# Altium project canbus_motor_drive.PrjPcb
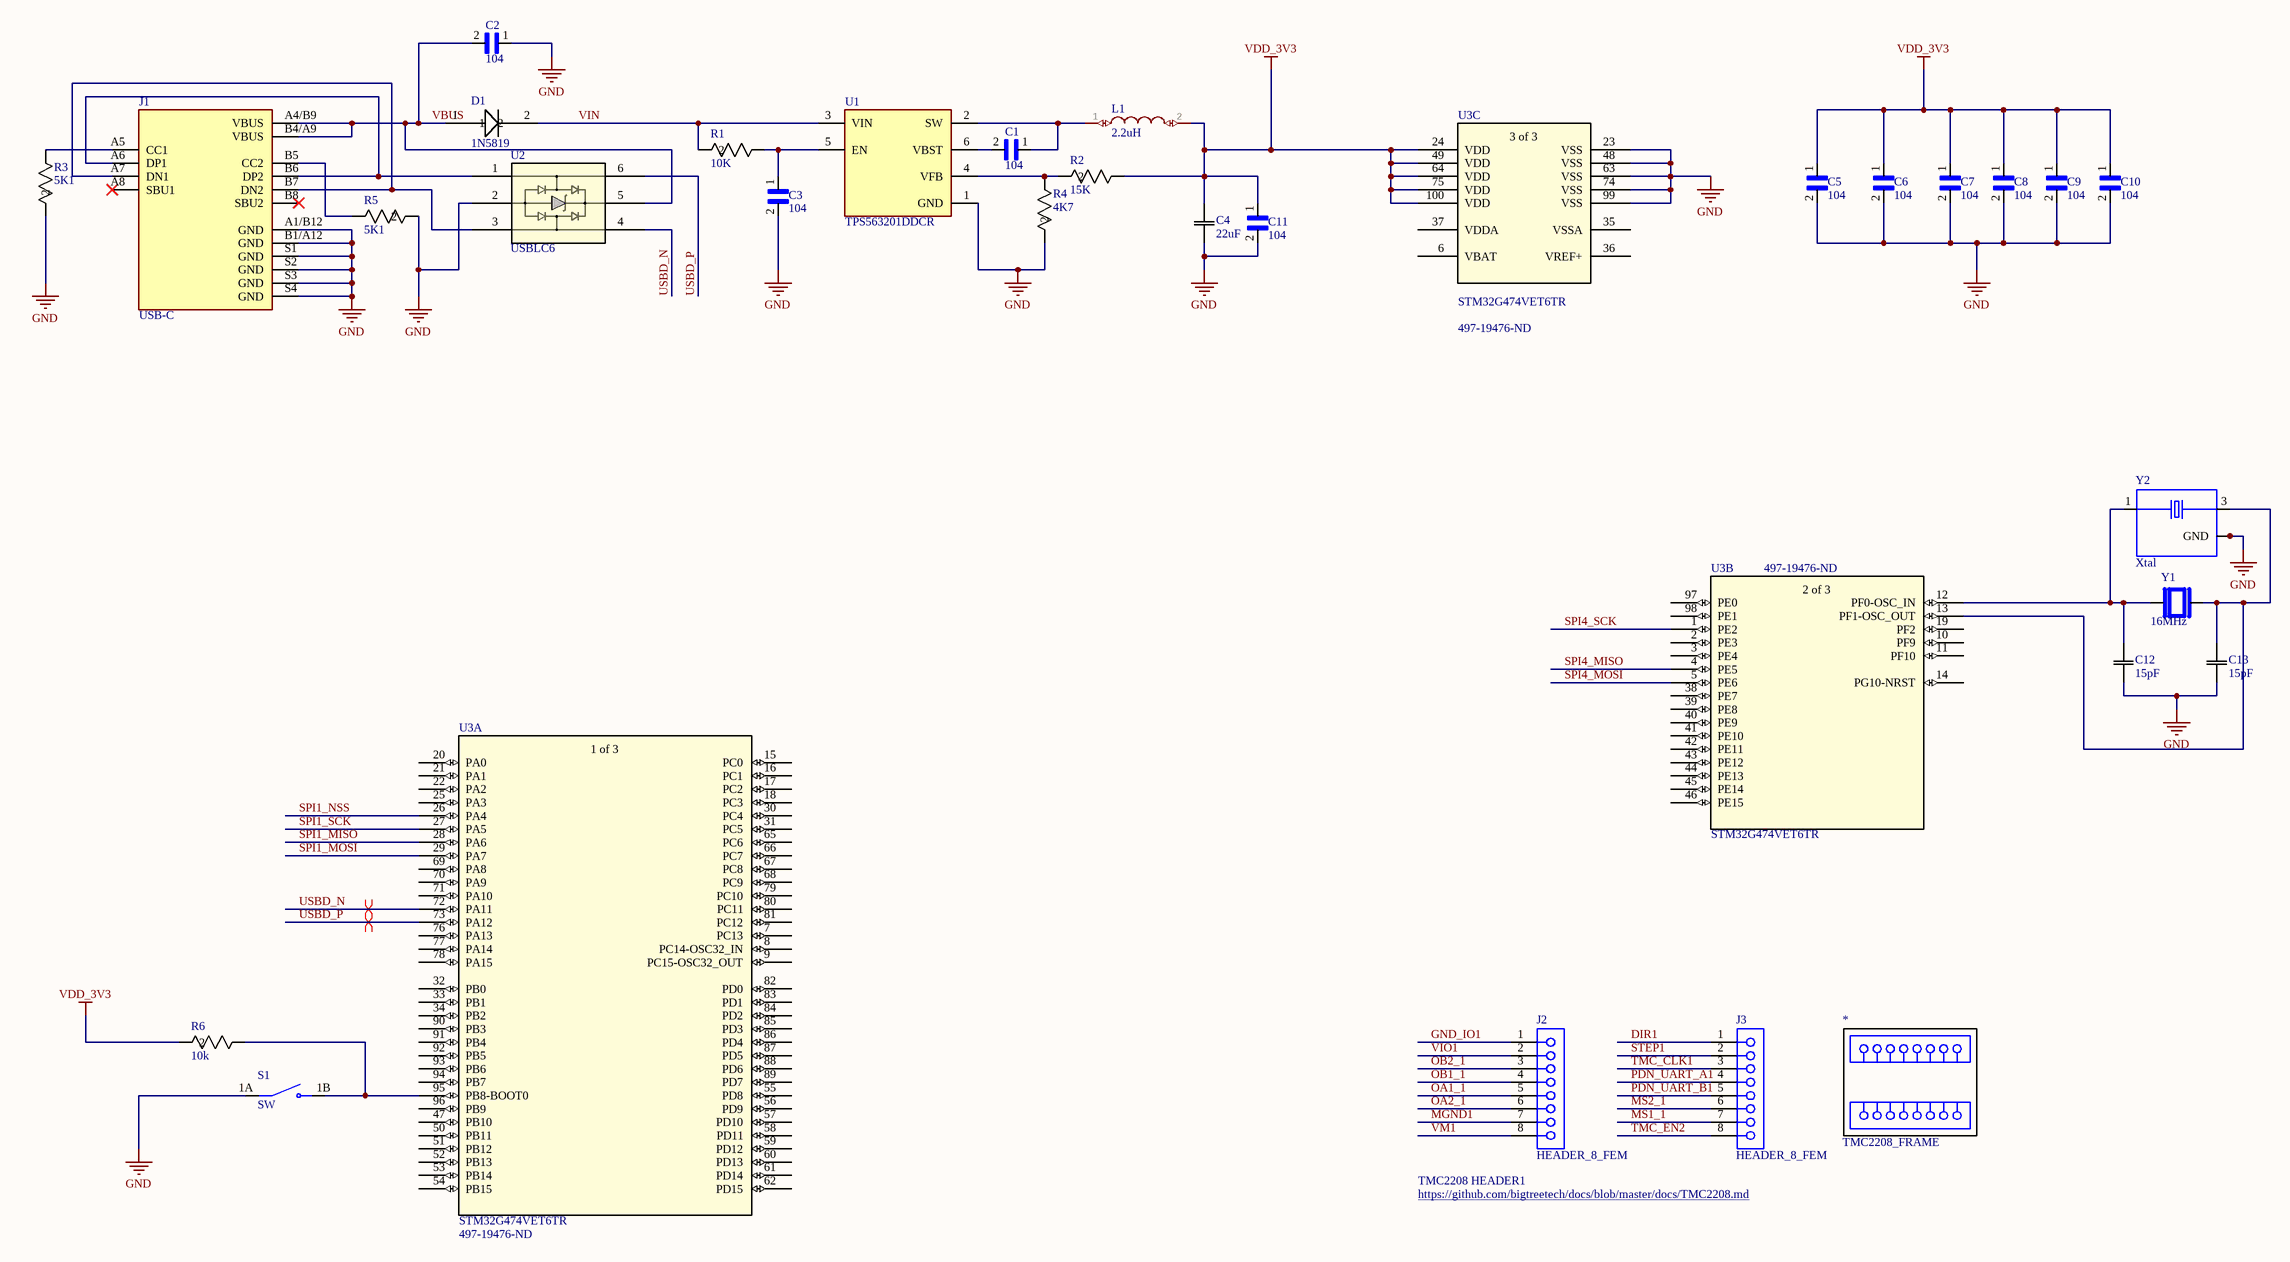
[diagram p0: main.SchDoc]
1 sheet, 31 parts. Net scope: global (net labels, ports and power ports of the same name join across sheets).
Board file: main.PcbDoc

## Sheet main.SchDoc
size C; SheetNumber: 1; SheetTotal: 1

### Parts
*  TMC2208_FRAME
C1  104  [CAPC1005X55N2]
C2  104  [CAPC1005X55N2]
C3  104  [CAPC1005X55N2]
C4  22uF  [CAP_CC0805_YAG]
C5  104  [CAPC1005X55N2]
C6  104  [CAPC1005X55N2]
C7  104  [CAPC1005X55N2]
C8  104  [CAPC1005X55N2]
C9  104  [CAPC1005X55N2]
C10  104  [CAPC1005X55N2]
C11  104  [CAPC1005X55N2]
C12  15pF  [CC0402N_YAG-L]
C13  15pF  [CC0402N_YAG-L]
D1  1N5819  [1N5819HW-7-F_DIO]
J1  USB-C  [GCT_USB4110GFA]
J2  HEADER_8_FEM  [HEADER_8_FEM]
J3  HEADER_8_FEM  [HEADER_8_FEM]
L1  2.2uH  [CDRH2D14]
R1  10K  [RC0402]
R2  15K  [RC0402]
R3  5K1  [RC0402]
R4  4K7  [RC0402]
R5  5K1  [RC0402]
R6  10k  [RC0402]
S1  SW  [SW_DS04-254-2-01BK-SMT]
U1  TPS563201DDCR  [SOT95P280X110-6N]
U2  USBLC6  [SOT23-6L_STM]
U3  STM32G474VET6TR  Supplier Part Number 1: 497-19476-ND  [STM32G474VET6TR]  (parts A,B,C of 3)
Y1  16MHz  [ABM3-16.000MHZ-D2Y-T]
Y2  Xtal  [OSCCC320X250X60N]

### Nets
GND: C2.1 C3.2 C4.1 C5.2 C6.2 C7.2 C8.2 C9.2 C10.2 C11.2 C12.1 C13.1 J1.A1/B12(GND) J1.B1/A12(GND) J1.S1(GND) J1.S2(GND) J1.S3(GND) J1.S4(GND) R3.2 R4.2 R5.2 S1.1A(COM) U1.1(GND) U2.2 U3.23(VSS) U3.48(VSS) U3.63(VSS) U3.74(VSS) U3.99(VSS) Y2.2(GND) Y2.4(GND)
VDD_3V3: C4.2 C5.1 C6.1 C7.1 C8.1 C9.1 C10.1 C11.1 L1.2 R2.1 R6.2 U3.24(VDD) U3.49(VDD) U3.64(VDD) U3.75(VDD) U3.100(VDD)
DIR1: J3.1
GND_IO1: J2.1
MGND1: J2.7
MS1_1: J3.7
MS2_1: J3.6
OA1_1: J2.5
OA2_1: J2.6
OB1_1: J2.4
OB2_1: J2.3
PDN_UART_A1: J3.4
PDN_UART_B1: J3.5
SPI1_MISO: U3.28(PA6)
SPI1_MOSI: U3.29(PA7)
SPI1_NSS: U3.26(PA4)
SPI1_SCK: U3.27(PA5)
SPI4_MISO: U3.4(PE5)
SPI4_MOSI: U3.5(PE6)
SPI4_SCK: U3.1(PE2)
STEP1: J3.2
TMC_CLK1: J3.3
TMC_EN2: J3.8
USBD_N: U2.4 U3.72(PA11)
USBD_P: U2.6 U3.73(PA12)
VBUS: C2.2 D1.1 J1.A4/B9(VBUS) J1.B4/A9(VBUS) U2.5
VIN: D1.2 R1.2 U1.3(VIN)
VIO1: J2.2
VM1: J2.8
NetC1_1: C1.1 L1.1 U1.2(SW)
NetC1_2: C1.2 U1.6(VBST)
NetC3_1: C3.1 R1.1 U1.5(EN)
NetC12_2: C12.2 U3.12(PF0-OSC_IN) Y1.1 Y2.1
NetC13_2: C13.2 U3.13(PF1-OSC_OUT) Y1.2 Y2.3
NetJ1_A5: J1.A5(CC1) R3.1
NetJ1_A6: J1.A6(DP1) J1.B6(DP2) U2.1
NetJ1_A7: J1.A7(DN1) J1.B7(DN2) U2.3
NetJ1_B5: J1.B5(CC2) R5.1
NetR2_2: R2.2 R4.1 U1.4(VFB)
NetR6_1: R6.1 S1.1B(NO) U3.95(PB8-BOOT0)

Not connected (* = marked no-connect by the designer): J1 A8(SBU1)* B8(SBU2)*; U3 2(PE3) 3(PE4) 6(VBAT) 7(PC13) 8(PC14-OSC32_IN) 9(PC15-OSC32_OUT) 10(PF9) 11(PF10) 14(PG10-NRST) 15(PC0) 16(PC1) 17(PC2) 18(PC3) 19(PF2) 20(PA0) 21(PA1) 22(PA2) 25(PA3) 30(PC4) 31(PC5) 32(PB0) 33(PB1) 34(PB2) 35(VSSA) 36(VREF+) 37(VDDA) 38(PE7) 39(PE8) 40(PE9) 41(PE10) 42(PE11) 43(PE12) 44(PE13) 45(PE14) 46(PE15) 47(PB10) 50(PB11) 51(PB12) 52(PB13) 53(PB14) 54(PB15) 55(PD8) 56(PD9) 57(PD10) 58(PD11) 59(PD12) 60(PD13) 61(PD14) 62(PD15) 65(PC6) 66(PC7) 67(PC8) 68(PC9) 69(PA8) 70(PA9) 71(PA10) 76(PA13) 77(PA14) 78(PA15) 79(PC10) 80(PC11) 81(PC12) 82(PD0) 83(PD1) 84(PD2) 85(PD3) 86(PD4) 87(PD5) 88(PD6) 89(PD7) 90(PB3) 91(PB4) 92(PB5) 93(PB6) 94(PB7) 96(PB9) 97(PE0) 98(PE1)

### Layout directives
differential pair: USBD_N, USBD_P

### Notes on the sheet
- (near J2) TMC2208 HEADER1
- https://github.com/bigtreetech/docs/blob/master/docs/TMC2208.md
- (in symbol STM32G474VET6, part A) 1 of 3
- (in symbol STM32G474VET6, part B) 2 of 3
- (in symbol STM32G474VET6, part C) 3 of 3

### Library data of the parts
C1-C3 C5-C11 = CC0402KRX7R7BB104: Multilayer Ceramic Capacitor, 0.1 uF, 16 V, ï¿½ 10%, X7R, 0402 [1005 Metric]; Manufacturer: Yageo; Material: 4241ConductorMaterial; Capacitance: 100nF; Voltage Rating: 16V; Temperature Coefficient: 30ppm/°C; Supplier 1: Digikey; Manufacturer Part Number: CC0402KRX7R7BB104; RoHS: Yes; Category: Ceramic Capacitors; Stock 1: 15609894; Pricing 1: 1=0.1, 10=0.024, 50=0.0164, 100=0.0139, 500=0.0098, 1000=0.00852, 2500=0.00718, 5000=0.00636 (USD); Mount: Surface Mount; Case/Package: 0402; Number of Pins: 2; Case Code (Metric): 1005; Case Code (Imperial): 0402; Min Operating Temperature: -55°C; Max Operating Temperature: 125°C; Tolerance: 10%; Voltage Rating (DC): 16V; Packaging: Tape and Reel; Package Quantity: 1; Dielectric: X7R; Termination: SMD/SMT; Voltage: 16V; Series: CC; Voltage Rating (AC): 16V; Length: 1mm; Width: 0.02inch; Height: 0.5mm; Thickness: 0.022inch; Depth: 0.5mm; Radiation Hardening: No; Reach SVHC Compliant: No; RoHS Compliant: Yes; Halogen Free: 5694HalogenFree; Lead Free: 5697LeadFree; ComponentLink1URL: https://datasheet.ciiva.com/11788/0900766b80ce67ed-11788364.pdf?src-supplier=Rs; ComponentLink1Description: https://datasheet.ciiva.com/11788/0900766b80ce67ed-11788364.pdf?src-supplier=Rs; ComponentLink2URL: https://datasheet.ciiva.com/7978/1489800-7978111.pdf?src-supplier=Element14; ComponentLink2Description: https://datasheet.ciiva.com/7978/1489800-7978111.pdf?src-supplier=Element14; ComponentLink3URL: https://datasheet.ciiva.com/161/mlccorderingcode-161545.pdf?src-supplier=Digikey; ComponentLink3Description: https://datasheet.ciiva.com/161/mlccorderingcode-161545.pdf?src-supplier=Digikey; ComponentLink4URL: https://datasheet.ciiva.com/161/mlccorderingcode-161544.pdf?src-supplier=Digikey; ComponentLink4Description: https://datasheet.ciiva.com/161/mlccorderingcode-161544.pdf?src-supplier=Digikey; ComponentLink5URL: https://datasheet.ciiva.com/161/mlccorderingcode-161546.pdf?src-supplier=Digikey; ComponentLink5Description: https://datasheet.ciiva.com/161/mlccorderingcode-161546.pdf?src-supplier=Digikey; ComponentLink6URL: https://datasheet.ciiva.com/8033/1734573-8033661.pdf?src-supplier=Element14; ComponentLink6Description: https://datasheet.ciiva.com/8033/1734573-8033661.pdf?src-supplier=Element14; ComponentLink7URL: https://datasheet.ciiva.com/11587/upy-gphc-x7r-6-3v-to-50v-8-11587305.pdf?src-supplier=Avnet; ComponentLink7Description: https://datasheet.ciiva.com/11587/upy-gphc-x7r-6-3v-to-50v-8-11587305.pdf?src-supplier=Avnet; LCSC: C60474; Supplier Part Number 1: 311-1338-1-ND
C4 = CC0805MKX5R6BB226: Multilayer Ceramic Capacitor, 22 uF, 10 V, ± 20%, X5R, 0805 [2012 Metric]; Manufacturer: Yageo; Supplier 1: Digikey; Manufacturer Part Number: CC0805MKX5R6BB226; RoHS: Yes; Category: Ceramic Capacitors; Stock 1: 418703; Pricing 1: 1=0.39, 10=0.229, 50=0.1654, 100=0.1457, 500=0.11208, 1000=0.10161 (USD); Lead Free: 5697LeadFree; Halogen Free: 5694HalogenFree; ComponentLink1URL: https://datasheet.ciiva.com/26863/getdatasheetpartid-573628-26863004.pdf?src-supplier=Verical; ComponentLink1Description: https://datasheet.ciiva.com/26863/getdatasheetpartid-573628-26863004.pdf?src-supplier=Verical; LCSC: C109314; Supplier Part Number 1: 311-1900-1-ND
C12 C13 = CC0402JRNPO9BN150: Multilayer Ceramic Capacitor, 15 pF, 50 V, ± 5%, C0G (NP0), 0402 [1005 Metric]; Manufacturer: Yageo; Dielectric Material: 4241ConductorMaterial; Voltage Rating: 50V; Temperature Coefficient: 30ppm/°C; Insulation Resistance: 100GR; Supplier 1: Digikey; Manufacturer Part Number: CC0402JRNPO9BN150; RoHS: Yes; Category: Ceramic Capacitors; Stock 1: 476708; Pricing 1: 1=0.1, 10=0.023, 50=0.0152, 100=0.0129, 500=0.00904, 1000=0.00785, 2500=0.0066, 5000=0.00584 (USD); Mount: Surface Mount; Case/Package: 0402; Number of Pins: 2; Case Code (Metric): 1005; Case Code (Imperial): 0402; Min Operating Temperature: -55°C; Max Operating Temperature: 125°C; Capacitance: 15pF; Tolerance: 5%; Voltage Rating (DC): 50V; Package Quantity: 1; Packaging: Tape and Reel; Dielectric: C0G; Termination: SMD/SMT; Voltage: 50V; Series: CC; Voltage Rating (AC): 50V; Length: 1mm; Width: 0.02inch; Height: 0.5mm; Thickness: 0.022inch; Depth: 0.5mm; Radiation Hardening: No; Reach SVHC Compliant: No; RoHS Compliant: Yes; Halogen Free: 5694HalogenFree; Lead Free: 5697LeadFree; ComponentLink1URL: https://datasheet.ciiva.com/144/mlccorderingcode-144002.pdf?src-supplier=Digikey; ComponentLink1Description: https://datasheet.ciiva.com/144/mlccorderingcode-144002.pdf?src-supplier=Digikey; ComponentLink2URL: https://datasheet.ciiva.com/144/mlccorderingcode-144001.pdf?src-supplier=Digikey; ComponentLink2Description: https://datasheet.ciiva.com/144/mlccorderingcode-144001.pdf?src-supplier=Digikey; ComponentLink3URL: https://datasheet.ciiva.com/144/mlccorderingcode-144003.pdf?src-supplier=Digikey; ComponentLink3Description: https://datasheet.ciiva.com/144/mlccorderingcode-144003.pdf?src-supplier=Digikey; ComponentLink4URL: https://datasheet.ciiva.com/13386/upy-gp-np0-16v-to-50v-8-13386330.pdf?src-supplier=Mouser; ComponentLink4Description: https://datasheet.ciiva.com/13386/upy-gp-np0-16v-to-50v-8-13386330.pdf?src-supplier=Mouser; ComponentLink5URL: https://datasheet.ciiva.com/11587/upy-gp-np0-16v-to-50v-8-11587085.pdf?src-supplier=Avnet; ComponentLink5Description: https://datasheet.ciiva.com/11587/upy-gp-np0-16v-to-50v-8-11587085.pdf?src-supplier=Avnet; LCSC: C106997; Supplier Part Number 1: 311-1017-1-ND
D1 = 1N5819HW-7-F: 1N5819HW Series 40 V 1 A Surface Mount Schottky Barrier Rectifier - SOD-123; Manufacturer: Diodes; Forward Voltage: 450mV; Forward Current: 1A; Max Power Dissipation: 450mW; Max Reverse Current: 50uA; Max Repetitive Reverse Voltage (Vrrm): 40V; Max Forward Surge Current (Ifsm): 25A; Polarity: Standard; Capacitance: 50pF; Supplier 1: Digikey; Manufacturer Part Number: 1N5819HW-7-F; RoHS: Yes; Category: Rectifier Diodes; Stock 1: 70594; Pricing 1: 1=0.25, 10=0.17, 100=0.1143, 500=0.08782, 1000=0.07897 (USD); Case/Package: SOD-123-2; Number of Pins: 2; Weight: 0.000353oz; Min Operating Temperature: -65°C; Max Operating Temperature: 125°C; Package Quantity: 3000; Packaging: Tape and Reel; Average Rectified Current: 1A; Peak Non-Repetitive Surge Current: 25A; Termination: SMD/SMT; Voltage Rating (DC): 40V; Current Rating: 1A; Output Current: 1A; Max Reverse Voltage (DC): 40V; Series: -; Reverse Voltage: 40V; Length: 2.85mm; Width: 1.7mm; Height: 1.25mm; Radiation Hardening: No; Reach SVHC Compliant: No; Lead Free: Lead Free; RoHS Compliant: Yes; ComponentLink1URL: https://datasheet.ciiva.com/912/ds30217-912801.pdf?src-supplier=Digikey; ComponentLink1Description: https://datasheet.ciiva.com/912/ds30217-912801.pdf?src-supplier=Digikey; ComponentLink2URL: https://datasheet.ciiva.com/912/ds30217-912802.pdf?src-supplier=Digikey; ComponentLink2Description: https://datasheet.ciiva.com/912/ds30217-912802.pdf?src-supplier=Digikey; ComponentLink3URL: https://datasheet.ciiva.com/912/ds30217-912803.pdf?src-supplier=Digikey; ComponentLink3Description: https://datasheet.ciiva.com/912/ds30217-912803.pdf?src-supplier=Digikey; ComponentLink4URL: https://datasheet.ciiva.com/8303/ds30217-8303132.pdf?src-supplier=Avnet; ComponentLink4Description: https://datasheet.ciiva.com/8303/ds30217-8303132.pdf?src-supplier=Avnet; ComponentLink5URL: https://datasheet.ciiva.com/1177/ds30217-1177089.pdf?src-supplier=Element14; ComponentLink5Description: https://datasheet.ciiva.com/1177/ds30217-1177089.pdf?src-supplier=Element14; Supplier Part Number 1: 1N5819HW-FDICT-ND; LCSC: C82544
J1 = USB4110-GF-A: USB Connector, 16 Contact(s), Male, Right Angle, Surface Mount Terminal, Locking, Receptacle; Manufacturer: Global Connector Technology; USB Standard: 6108USBStandard; Number of Contacts: 16NUMBER; Voltage Rating: 20V; Supplier 1: Digikey; Manufacturer Part Number: USB4110-GF-A; RoHS: No; Category: USB Connectors; Stock 1: 30215; Pricing 1: 1=1.64, 10=1.244, 25=1.1176, 50=1.032, 100=0.9547, 250=0.86368, 500=0.80254 (USD); Number of Pins: 16NUMBER; Contact Material: 153,157ConductorMaterial; Orientation: 5496OrientationType; Height: 3.46mm; ComponentLink1URL: https://gct.co/files/drawings/usb4110.pdf?src-supplier=Digikey; ComponentLink1Description: https://gct.co/files/drawings/usb4110.pdf?src-supplier=Digikey; Supplier Part Number 1: 2073-USB4110-GF-A-1-ND; LCSC: USB4110-GF-A
J2 J3 = HEADER_8_FEM: Btb Conn, Rcpt, 8Pos, 1Row, 2.54Mm Rohs Compliant: Yes |Wurth Elektronik 61300811821; Manufacturer: Wurth Electronics; Contact Resistance: 20mR; Current Rating: 3A; Operating Supply Voltage: 250V; Gender: 30Gender; Supplier 1: Digikey; Manufacturer Part Number: 61300811821; RoHS: Yes; Category: LDO; Stock 1: 3282; Pricing 1: 1=0.41, 10=0.39, 100=0.375, 250=0.359, 500=0.345 (USD); Number of Pins: 8NUMBER; Orientation: 5495OrientationType; Lead Pitch: 2.54mm; LCSC: C27438; Supplier Part Number 1: 732-61300811821-ND
L1 = CDRH2D14NP-2R2NC: 2.2µH Shielded  Inductor 1.6A 94 mOhm Max Nonstandard; Manufacturer: Sumida; Supplier 1: Digikey; Manufacturer Part Number: CDRH2D14NP-2R2NC; RoHS: Yes; Category: Fixed Inductors; Stock 1: 95645; Pricing 1: 1=1, 10=0.776, 25=0.7016, 50=0.65, 100=0.6022, 250=0.5442, 500=0.50392 (USD); ComponentLink1URL: http://www.mouser.com/ds/2/390/CDRH2D14-523410.pdf?src-supplier=Mouser; ComponentLink1Description: http://www.mouser.com/ds/2/390/CDRH2D14-523410.pdf?src-supplier=Mouser; ComponentLink2URL: http://www.sumida.com/products/pdf/CDRH2D14.pdf?src-supplier=Avnet; ComponentLink2Description: http://www.sumida.com/products/pdf/CDRH2D14.pdf?src-supplier=Avnet; ComponentLink3URL: http://www.sumida.com/products/pdf/CDRH2D14.pdf?src-supplier=Digikey; ComponentLink3Description: http://www.sumida.com/products/pdf/CDRH2D14.pdf?src-supplier=Digikey; ComponentLink4URL: http://products.sumida.com/products/pdf/CDRH2D14.pdf?src-supplier=Digikey; ComponentLink4Description: http://products.sumida.com/products/pdf/CDRH2D14.pdf?src-supplier=Digikey; ComponentLink5URL: http://www.sumida.com/products/pdf/CDRH2D14,2D14BLD.pdf?src-supplier=Future+Electronics; ComponentLink5Description: http://www.sumida.com/products/pdf/CDRH2D14,2D14BLD.pdf?src-supplier=Future+Electronics; ComponentLink6URL: https://datasheet.octopart.com/CDRH2D14NP-2R2NC-Sumida-datasheet-13694704.pdf?src-supplier=Future+Electronics; ComponentLink6Description: https://datasheet.octopart.com/CDRH2D14NP-2R2NC-Sumida-datasheet-13694704.pdf?src-supplier=Future+Electronics; ComponentLink7URL: https://datasheet.octopart.com/CDRH2D14NP-2R2NC-Sumida-datasheet-81411419.pdf?src-supplier=LKR; ComponentLink7Description: https://datasheet.octopart.com/CDRH2D14NP-2R2NC-Sumida-datasheet-81411419.pdf?src-supplier=LKR; LCSC: C167267; Supplier Part Number 1: 308-2294-1-ND
R1 R6 = RC0402FR-0710KL: SMD Chip Resistor, 10 kOhm, ï¿½ 1%, 62.5 mW, 0402 [1005 Metric], Thick Film, General Purpose; Manufacturer: Yageo; Resistance: 10kR; Temperature Coefficient: 100ppm/°C; Voltage Rating (DC): 50V; Power Rating: 62.5mW; Max Power Dissipation: 63mW; Supplier 1: Digikey; Manufacturer Part Number: RC0402FR-0710KL; RoHS: Yes; Category: Chip SMD Resistors; Stock 1: 7390601; Pricing 1: 1=0.1, 10=0.009, 50=0.0072, 100=0.0051, 500=0.00408, 5000=0.00306 (USD); Case/Package: 0402; Number of Pins: 2; Case Code (Imperial): 0402; Case Code (Metric): 1005; Min Operating Temperature: -55°C; Max Operating Temperature: 155°C; Tolerance: 1%; Packaging: Tape and Reel; Resistor Type: Thick Film; Voltage Rating: 50V; Termination: SMD/SMT; Number of Terminations: 2; Features: Moisture Resistant; Series: RC; Resistance Tolerance: 1%; Construction: Rectangular; Length: 1mm; Width: 0.5mm; Depth: 0.5mm; Lead Pitch: 0.2mm; Reach SVHC Compliant: Unknown; Lead Free: 5697LeadFree; Military Standard: Not; RoHS Compliant: Yes; ComponentLink1URL: https://datasheet.ciiva.com/7660/38568-7660787.pdf?src-supplier=Element14; ComponentLink1Description: https://datasheet.ciiva.com/7660/38568-7660787.pdf?src-supplier=Element14; ComponentLink2URL: https://datasheet.ciiva.com/7849/1686128-7849814.pdf?src-supplier=Element14; ComponentLink2Description: https://datasheet.ciiva.com/7849/1686128-7849814.pdf?src-supplier=Element14; ComponentLink3URL: https://datasheet.ciiva.com/7983/1018594-7983486.pdf?src-supplier=Element14; ComponentLink3Description: https://datasheet.ciiva.com/7983/1018594-7983486.pdf?src-supplier=Element14; ComponentLink4URL: https://datasheet.ciiva.com/22747/1018594-22747512.pdf?src-supplier=Element14; ComponentLink4Description: https://datasheet.ciiva.com/22747/1018594-22747512.pdf?src-supplier=Element14; ComponentLink5URL: https://datasheet.ciiva.com/12667/pyu-rc0402-51-rohs-l-6-r-12667067.pdf?src-supplier=Mouser; ComponentLink5Description: https://datasheet.ciiva.com/12667/pyu-rc0402-51-rohs-l-6-r-12667067.pdf?src-supplier=Mouser; ComponentLink6URL: https://datasheet.ciiva.com/7849/1784430-7849813.pdf?src-supplier=Element14; ComponentLink6Description: https://datasheet.ciiva.com/7849/1784430-7849813.pdf?src-supplier=Element14; ComponentLink7URL: https://datasheet.ciiva.com/7849/1784430-7849815.pdf?src-supplier=Element14; ComponentLink7Description: https://datasheet.ciiva.com/7849/1784430-7849815.pdf?src-supplier=Element14; LCSC: C60490; Supplier Part Number 1: 311-10.0KLRCT-ND
R2 = RT0402BRD0715KL: Res Thin Film 0402 15K Ohm 0.1% 0.063W(1/16W) ±25ppm/C Pad SMD T/R; Manufacturer: Yageo; Supplier 1: Digikey; Manufacturer Part Number: RT0402BRD0715KL; RoHS: Yes; Category: Chip SMD Resistors; Stock 1: 59202; Pricing 1: 1=0.17, 10=0.119, 50=0.097, 100=0.0867, 500=0.0663, 1000=0.05814, 5000=0.04386 (USD); ComponentLink1URL: https://datasheet.ciiva.com/12723/pyu-rt-1-to-0-05-rohs-l-4-12723782.pdf?src-supplier=Mouser; ComponentLink1Description: https://datasheet.ciiva.com/12723/pyu-rt-1-to-0-05-rohs-l-4-12723782.pdf?src-supplier=Mouser; ComponentLink2URL: https://datasheet.ciiva.com/2582/pyu-rt-1-to-0-05-rohs-l-5-2582151.pdf?src-supplier=Digikey; ComponentLink2Description: https://datasheet.ciiva.com/2582/pyu-rt-1-to-0-05-rohs-l-5-2582151.pdf?src-supplier=Digikey; LCSC: C852545; Supplier Part Number 1: YAG2302CT-ND
R3 R5 = RC0402FR-075K1L: SMD Chip Resistor, 5.1 kOhm, ï¿½ 1%, 62.5 mW, 0402 [1005 Metric], Thick Film, General Purpose; Manufacturer: Yageo; Power Rating: 63mW; Voltage Rating: 50V; Resistance: 5.1kR; Temperature Coefficient: 100ppm/°C; Supplier 1: Digikey; Manufacturer Part Number: RC0402FR-075K1L; RoHS: Yes; Category: Chip SMD Resistors; Stock 1: 868211; Pricing 1: 1=0.1, 10=0.009, 50=0.0072, 100=0.0041, 500=0.00306 (USD); Case/Package: 0402; Case Code (Metric): 1005; Case Code (Imperial): 0402; Min Operating Temperature: -55°C; Max Operating Temperature: 155°C; Tolerance: 1%; Packaging: Tape and Reel; Package Quantity: 1; Resistor Type: Thick Film; Number of Terminations: 2; Termination: SMD/SMT; Max Power Dissipation: 63mW; Features: Moisture Resistant; Series: RC; Resistance Tolerance: 1%; Technology: THICK FILM; Voltage Rating (DC): 50V; Working Voltage: 50V; Construction: Rectangular; Length: 1mm; Width: 0.02inch; Height: 0.016inch; Depth: 0.5mm; RoHS Compliant: Yes; Reach SVHC Compliant: Unknown; Lead Free: 5697LeadFree; Military Standard: Not; Supplier Part Number 1: 311-5.10KLRCT-ND; LCSC: C105872
R4 = RC0402JR-074K7L: SMD Chip Resistor, 4.7 kOhm, ï¿½ 5%, 62.5 mW, 0402 [1005 Metric], Thick Film, General Purpose; Manufacturer: Yageo; Voltage Rating: 50V; Resistance: 4.7kR; Power Rating: 62.5mW; Temperature Coefficient: 100ppm/°C; Max Power Dissipation: 63mW; Supplier 1: Digikey; Manufacturer Part Number: RC0402JR-074K7L; RoHS: Yes; Category: Chip SMD Resistors; Stock 1: 17920115; Pricing 1: 1=0.1, 10=0.008, 50=0.0062, 100=0.0041, 500=0.00356, 1000=0.00306 (USD); Case/Package: 0402; Case Code (Imperial): 0402; Case Code (Metric): 1005; Size Code: 0402; Min Operating Temperature: -55°C; Max Operating Temperature: 155°C; Tolerance: 5%; Packaging: Tape and Reel; Package Quantity: 1; Termination: SMD/SMT; Resistor Type: Thick Film; Number of Terminations: 2; Features: Moisture Resistant; Series: RC; Resistance Tolerance: 5%; Voltage Rating (AC): 50V; Length: 0.039inch; Width: 0.02inch; Height: 0.016inch; Reach SVHC Compliant: No; Lead Free: Lead Free; RoHS Compliant: Yes; ComponentLink1URL: https://datasheet.ciiva.com/2452/pyu-r-int-thick-7-2452611.pdf?src-supplier=Digikey; ComponentLink1Description: https://datasheet.ciiva.com/2452/pyu-r-int-thick-7-2452611.pdf?src-supplier=Digikey; ComponentLink2URL: https://datasheet.ciiva.com/2452/pyu-r-int-thick-7-2452612.pdf?src-supplier=Digikey; ComponentLink2Description: https://datasheet.ciiva.com/2452/pyu-r-int-thick-7-2452612.pdf?src-supplier=Digikey; ComponentLink3URL: https://datasheet.ciiva.com/2452/pyu-r-int-thick-7-2452613.pdf?src-supplier=Digikey; ComponentLink3Description: https://datasheet.ciiva.com/2452/pyu-r-int-thick-7-2452613.pdf?src-supplier=Digikey; ComponentLink4URL: https://datasheet.ciiva.com/16800/pyu-rc0402-51-rohs-l-6-r-16800266.pdf?src-supplier=Future+Electronics; ComponentLink4Description: https://datasheet.ciiva.com/16800/pyu-rc0402-51-rohs-l-6-r-16800266.pdf?src-supplier=Future+Electronics; ComponentLink5URL: https://datasheet.ciiva.com/46412/1018594-46412841.pdf?src-supplier=Element14; ComponentLink5Description: https://datasheet.ciiva.com/46412/1018594-46412841.pdf?src-supplier=Element14; ComponentLink6URL: https://datasheet.ciiva.com/7850/1018594-7850222.pdf?src-supplier=Element14; ComponentLink6Description: https://datasheet.ciiva.com/7850/1018594-7850222.pdf?src-supplier=Element14; ComponentLink7URL: https://datasheet.ciiva.com/7850/1018594-7850223.pdf?src-supplier=Element14; ComponentLink7Description: https://datasheet.ciiva.com/7850/1018594-7850223.pdf?src-supplier=Element14; Supplier Part Number 1: 311-4.7KJRCT-ND
S1 = DS04-254-2-01BK-SMT: Switch DIP OFF ON SPST 1 Flat Slide 0.025A 24VDC Gull Wing 2.54mm SMD Tube; Manufacturer: CUI Devices; Body Material: PBT,Polybutylene; Number of Positions: 1; Switching Current: 25mA; Switching Voltage: 24V; Actuator Type: Slide (Standard); Electrical Life: 2000Cycles; Washable: No; Supplier 1: Digikey; Manufacturer Part Number: DS04-254-2-01BK-SMT; RoHS: Yes; Category: DIP Switches; Stock 1: 6629; Pricing 1: 1=0.79, 10=0.643, 25=0.592, 120=0.513, 360=0.46325, 600=0.44157, 1080=0.41768, 2520=0.38509, 5040=0.35998 (USD); Mount: Surface Mount; Contact Material: Copper Alloy; Contact Plating: Gold; Min Operating Temperature: -40°C; Max Operating Temperature: 85°C; Throw Configuration: SPST; Series: DS04-254-SMT; Voltage Rating (DC): 24V; Termination: Gull Wing; Length: 3.54mm; Width: 6.2mm; Height: 3.66mm; Pitch: 2.54mm; ComponentLink1URL: https://www.cuidevices.com/product/resource/digikeypdf/ds04-254-smt.pdf?src-supplier=Digikey; ComponentLink1Description: https://www.cuidevices.com/product/resource/digikeypdf/ds04-254-smt.pdf?src-supplier=Digikey; ComponentLink2URL: https://datasheet.octopart.com/DS04-254-2-01BK-SMT-CUI-Devices-datasheet-175928987.pdf?src-supplier=Future+Electronics; ComponentLink2Description: https://datasheet.octopart.com/DS04-254-2-01BK-SMT-CUI-Devices-datasheet-175928987.pdf?src-supplier=Future+Electronics; ComponentLink3URL: https://datasheet.octopart.com/DS04-254-2-01BK-SMT-CUI-Devices-datasheet-154834557.pdf?src-supplier=Electro+Sonic; ComponentLink3Description: https://datasheet.octopart.com/DS04-254-2-01BK-SMT-CUI-Devices-datasheet-154834557.pdf?src-supplier=Electro+Sonic; LCSC: C5439760; Supplier Part Number 1: 2223-DS04-254-2-01BK-SMT-ND
U1 = TPS563201DDCR: Conv DC-DC 4.5V to 17V Synchronous Step Down Single-Out 0.76V to 7V 3A 6-Pin TSOT-23 T/R; Manufacturer: Texas Instruments; Number of Channels: 1NUMBER; Supplier 1: Digikey; Manufacturer Part Number: TPS563201DDCR; RoHS: Yes; Category: Voltage Regulators - Switching; Stock 1: 3511; Pricing 1: 1=0.38, 10=0.261, 25=0.2324, 100=0.2008, 250=0.18568, 500=0.17656, 1000=0.16907 (USD); Length: 2.9mm; Width: 1.6mm; Height: 1.1mm; Thickness: 870um; ComponentLink1URL: http://www.ti.com/general/docs/suppproductinfo.tsp?distId=10&amp;gotoUrl=http%3A%2F%2Fwww.ti.com%2Flit%2Fgpn%2Ftps563201&src-supplier=Digikey; ComponentLink1Description: http://www.ti.com/general/docs/suppproductinfo.tsp?distId=10&amp;gotoUrl=http%3A%2F%2Fwww.ti.com%2Flit%2Fgpn%2Ftps563201&src-supplier=Digikey; ComponentLink2URL: http://www.ti.com/lit/ds/symlink/tps563201.pdf?src-supplier=Digikey; ComponentLink2Description: http://www.ti.com/lit/ds/symlink/tps563201.pdf?src-supplier=Digikey; ComponentLink3URL: http://www.ti.com/lit/gpn/tps563201?src-supplier=Mouser; ComponentLink3Description: http://www.ti.com/lit/gpn/tps563201?src-supplier=Mouser; LCSC: C116592; Supplier Part Number 1: 296-47238-1-ND
U2 = USBLC6-2SC6: ESD Suppressor Diode Array Dual Uni-Dir 15kV Air Gap/15kV Contact Disc 6-Pin SOT-23 T/R; Manufacturer: STMicroelectronics; Data Rate: 480Mbps; Direction: Unidirectional,Bidirectional; Capacitance: 3.5pF; Operating Supply Voltage: 1.1V; Number of Elements: 1; Number of Channels: 2; Reverse Breakdown Voltage: 6V; Clamping Voltage: 17V; Working Voltage: 5V; Reverse Standoff Voltage: 5.25V; Power Line Protection: Yes; Test Current: 1mA; Max Reverse Leakage Current: 150nA; Peak Pulse Current: 5A; Supplier 1: Digikey; Manufacturer Part Number: USBLC6-2SC6; RoHS: Yes; Category: TVS Diodes; Stock 1: 85420; Pricing 1: 1=0.36, 10=0.243, 100=0.163, 500=0.127, 1000=0.114, 3000=0.09, 6000=0.084, 9000=0.078, 15000=0.077, 21000=0.0755, 30000=0.075 (USD); Mount: Surface Mount; Case/Package: SOT-23; Number of Pins: 6; Min Operating Temperature: -40°C; Max Operating Temperature: 125°C; Packaging: Tape and Reel; Package Quantity: 3000; Polarity: Unidirectional,Bidirectional; Breakdown Voltage: 6V; Termination: SMD/SMT; Number of Bidirectional Channels: 2; Min Breakdown Voltage: 6V; ESD Protection: Yes; Max Breakdown Voltage: 6V; Leakage Current: 150nA; Series: USB; Clamping Voltage-Max: 17V; Max Repetitive Reverse Voltage (Vrrm): 5.25V; Length: 3.05mm; Width: 1.75mm; Height: 1.3mm; Depth: 1.75mm; Radiation Hardening: No; Reach SVHC Compliant: No; Lead Free: Lead Free; RoHS Compliant: Yes; ComponentLink1URL: https://datasheet.ciiva.com/1268/1690354-1268384.pdf?src-supplier=Element14; ComponentLink1Description: https://datasheet.ciiva.com/1268/1690354-1268384.pdf?src-supplier=Element14; ComponentLink2URL: https://datasheet.ciiva.com/4508/cd00050750-113117-4508433.pdf?src-supplier=Mouser; ComponentLink2Description: https://datasheet.ciiva.com/4508/cd00050750-113117-4508433.pdf?src-supplier=Mouser; ComponentLink3URL: https://datasheet.ciiva.com/41444/001184109-da-01-en-ic-esd-protecti-usblc6-2sc6-sot-23-6-stm-41444156.pdf?src-supplier=Conrad; ComponentLink3Description: https://datasheet.ciiva.com/41444/001184109-da-01-en-ic-esd-protecti-usblc6-2sc6-sot-23-6-stm-41444156.pdf?src-supplier=Conrad; Supplier Part Number 1: 497-5235-1-ND; LCSC: C5250994
U3 = STM32G474VET6: MCU 32-Bit ARM Cortex-M4F RISC 512KB Flash 1.71V to 3.6V 100-Pin LQFP Tray; Manufacturer: STMicroelectronics; Core Architecture: 6081CoreArchitecture; Frequency: 170MHz; Min Supply Voltage: 1.62V; Number of A/D Converters: 5NUMBER; Number of Channels: 42NUMBER; Number of D/A Converters: 3NUMBER; Number of I2C Channels: 4NUMBER; Number of I/Os: 86NUMBER; Number of Timers/Counters: 2NUMBER; RAM Size: 128KB; Supplier 1: Digikey; Manufacturer Part Number: STM32G474VET6; RoHS: Yes; Category: Microcontrollers; Stock 1: 1871; Pricing 1: 1=9.21, 10=7.164, 25=6.6528, 90=6.12656, 270=5.80396, 450=5.68469, 990=5.53108 (USD); Min Operating Temperature: -40°C; Max Operating Temperature: 85°C; Density: 512KB; Max Supply Voltage: 3.6V; Number of SPI Channels: 4NUMBER; Number of UART Channels: 2NUMBER; Height: 1.6mm; ComponentLink1URL: http://www.farnell.com/datasheets/2818776.pdf?src-supplier=Farnell; ComponentLink1Description: http://www.farnell.com/datasheets/2818776.pdf?src-supplier=Farnell; ComponentLink2URL: https://www.st.com/resource/en/datasheet/stm32g474ve.pdf?src-supplier=Digikey; ComponentLink2Description: https://www.st.com/resource/en/datasheet/stm32g474ve.pdf?src-supplier=Digikey; ComponentLink3URL: https://datasheet.octopart.com/STM32G474VET6-STMicroelectronics-datasheet-136696182.pdf?src-supplier=LKR; ComponentLink3Description: https://datasheet.octopart.com/STM32G474VET6-STMicroelectronics-datasheet-136696182.pdf?src-supplier=LKR; LCSC: C431632
Y1 = ABM3-16.000MHZ-D2Y-T: Crystal 16MHz ±20ppm (Tol) ±30ppm (Stability) 18pF FUND 40Ohm 2-Pin Mini-CSMD T/R; Manufacturer: Abracon; Supplier 1: Digikey; Manufacturer Part Number: ABM3-16.000MHZ-D2Y-T; RoHS: Yes; Category: Crystals; Stock 1: 43168; Pricing 1: 1=0.56, 10=0.491, 50=0.445, 100=0.4266, 500=0.38674 (USD); ComponentLink1URL: https://datasheet.ciiva.com/28508/1754353-28508494.pdf?src-supplier=Element14; ComponentLink1Description: https://datasheet.ciiva.com/28508/1754353-28508494.pdf?src-supplier=Element14; ComponentLink2URL: https://datasheet.ciiva.com/4945/abm3-47699-4945397.pdf?src-supplier=Mouser; ComponentLink2Description: https://datasheet.ciiva.com/4945/abm3-47699-4945397.pdf?src-supplier=Mouser; ComponentLink3URL: https://datasheet.ciiva.com/855/abm3-855934.pdf?src-supplier=Digikey; ComponentLink3Description: https://datasheet.ciiva.com/855/abm3-855934.pdf?src-supplier=Digikey; ComponentLink4URL: https://datasheet.ciiva.com/855/abm3-855935.pdf?src-supplier=Digikey; ComponentLink4Description: https://datasheet.ciiva.com/855/abm3-855935.pdf?src-supplier=Digikey; ComponentLink5URL: https://datasheet.ciiva.com/855/abm3-855936.pdf?src-supplier=Digikey; ComponentLink5Description: https://datasheet.ciiva.com/855/abm3-855936.pdf?src-supplier=Digikey; ComponentLink6URL: https://datasheet.ciiva.com/7998/abm3-7998565.pdf?src-supplier=Element14; ComponentLink6Description: https://datasheet.ciiva.com/7998/abm3-7998565.pdf?src-supplier=Element14; LCSC: C596861; Supplier Part Number 1: 535-10638-1-ND
Y2 = CX3225SB16000D0GZJC1: Crystal 16.0000MHZ 8PF SMD; Manufacturer: Kyocera AVX; Frequency: 16MHz; ESR (Equivalent Series Resistance): 80R; Frequency Stability: 15ppm; Supplier 1: Digikey; Manufacturer Part Number: CX3225SB16000D0GZJC1; RoHS: Yes; Category: Crystals; Stock 1: 104939; Pricing 1: 1=0.59, 10=0.511, 50=0.4606, 100=0.4404, 500=0.39722, 1000=0.38002 (USD); Mount: Surface Mount; Case/Package: SMD/SMT; Min Operating Temperature: -25°C; Max Operating Temperature: 85°C; Packaging: Cut Tape; Load Capacitance: 8pF; Frequency Tolerance: 15ppm; Length: 0.126inch; Width: 0.098inch; Height: 0.024inch; Ratings: AEC-Q200; ComponentLink1URL: https://media.digikey.com/pdf/Data%20Sheets/AVX%20PDFs/CX3225SB16000D0GZJC1_Spec.pdf?src-supplier=Digikey; ComponentLink1Description: https://media.digikey.com/pdf/Data%20Sheets/AVX%20PDFs/CX3225SB16000D0GZJC1_Spec.pdf?src-supplier=Digikey; Supplier Part Number 1: 478-CX3225SB16000D0GZJC1CT-ND; LCSC: C13738